# Altium schematic sheet ver060_MCU.SchDoc
size A3; SheetNumber: 5; SheetTotal: 6
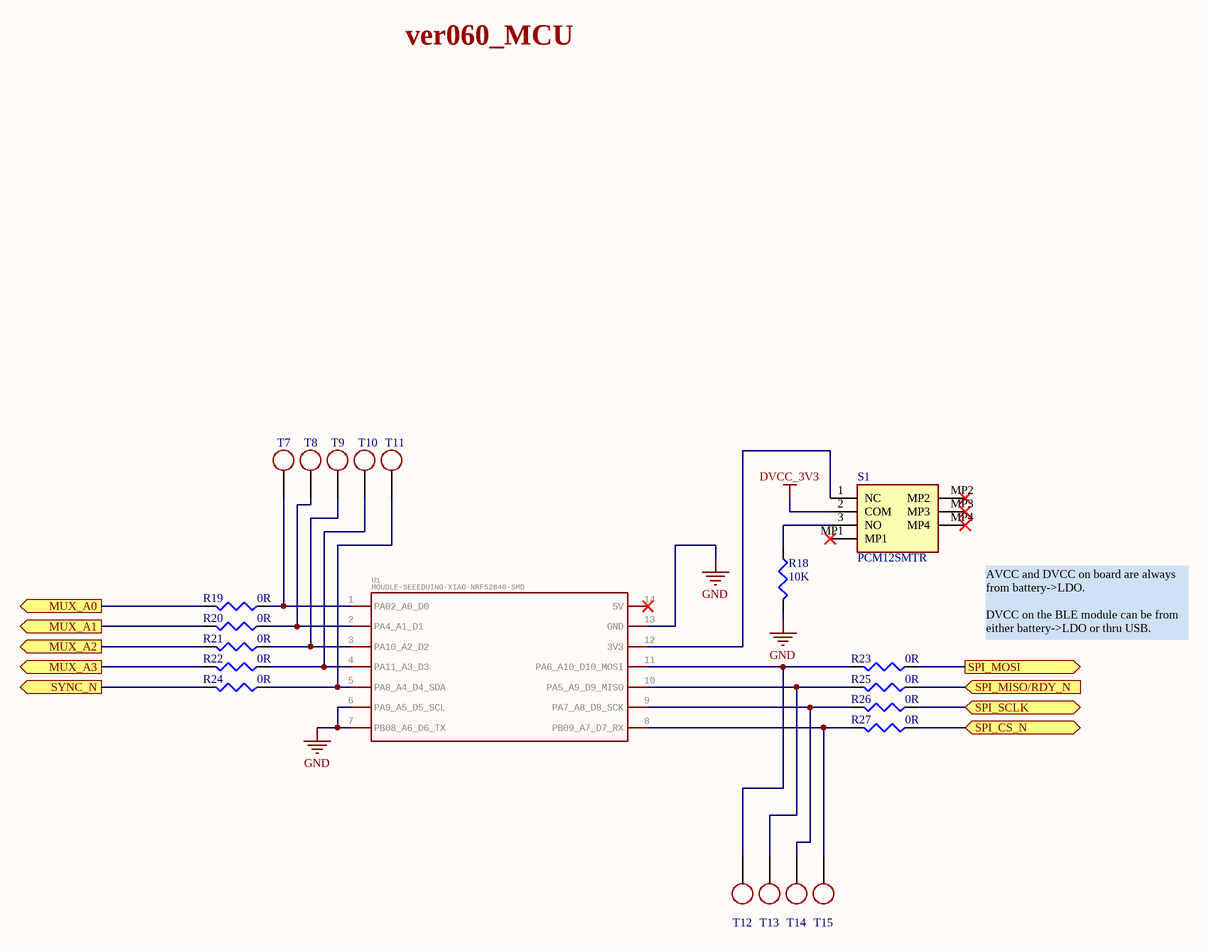
[diagram p0: ver060_MCU.SchDoc]

## Parts
R18  value 10K  [J1-0603]  (hidden comment: Res3)
R19  value 0R  [J1-0603]  (hidden comment: Res3)
R20  value 0R  [J1-0603]  (hidden comment: Res3)
R21  value 0R  [J1-0603]  (hidden comment: Res3)
R22  value 0R  [J1-0603]  (hidden comment: Res3)
R23  value 0R  [J1-0603]  (hidden comment: Res3)
R24  value 0R  [J1-0603]  (hidden comment: Res3)
R25  value 0R  [J1-0603]  (hidden comment: Res3)
R26  value 0R  [J1-0603]  (hidden comment: Res3)
R27  value 0R  [J1-0603]  (hidden comment: Res3)
S1  PCM12SMTR  [PCM12SMTR]
T7  TP_SMT  [TP_SMT_Round_0.6x0.6]  (value not drawn)
T8  TP_SMT  [TP_SMT_Round_0.6x0.6]  (value not drawn)
T9  TP_SMT  [TP_SMT_Round_0.6x0.6]  (value not drawn)
T10  TP_SMT  [TP_SMT_Round_0.6x0.6]  (value not drawn)
T11  TP_SMT  [TP_SMT_Round_0.6x0.6]  (value not drawn)
T12  TP_SMT  [TP_SMT_Round_0.6x0.6]  (value not drawn)
T13  TP_SMT  [TP_SMT_Round_0.6x0.6]  (value not drawn)
T14  TP_SMT  [TP_SMT_Round_0.6x0.6]  (value not drawn)
T15  TP_SMT  [TP_SMT_Round_0.6x0.6]  (value not drawn)
U1  MOUDLE-SEEEDUINO-XIAO-NRF52840-SMD  [MOUDLE16P-SMD-2-54-21X17-8MM]

## Ports
MUX_A0 (out), MUX_A1 (out), MUX_A2 (out), MUX_A3 (out), SPI_CS_N (bidir), SPI_MISO/RDY_N (in), SPI_MOSI (out), SPI_SCLK (bidir), SYNC_N (out)

## Nets
DVCC_3V3: S1.2(COM)
GND: R18.2 U1.6(PA9_A5_D5_SCL) U1.7(PB08_A6_D6_TX) U1.13(GND)
MUX_A0: R19.2 ; port MUX_A0
MUX_A1: R20.2 ; port MUX_A1
MUX_A2: R21.2 ; port MUX_A2
MUX_A3: R22.2 ; port MUX_A3
SPI_CS_N: R27.1 ; port SPI_CS_N
SPI_MISO/RDY_N: R25.1 ; port SPI_MISO/RDY_N
SPI_MOSI: R23.1 ; port SPI_MOSI
SPI_SCLK: R26.1 ; port SPI_SCLK
SYNC_N: R24.2 ; port SYNC_N
NetR18_1: R18.1 S1.3(NO)
NetR19_1: R19.1 T7.1 U1.1(PA02_A0_D0)
NetR20_1: R20.1 T8.1 U1.2(PA4_A1_D1)
NetR21_1: R21.1 T9.1 U1.3(PA10_A2_D2)
NetR22_1: R22.1 T10.1 U1.4(PA11_A3_D3)
NetR23_2: R23.2 T12.1 U1.11(PA6_A10_D10_MOSI)
NetR24_1: R24.1 T11.1 U1.5(PA8_A4_D4_SDA)
NetR25_2: R25.2 T13.1 U1.10(PA5_A9_D9_MISO)
NetR26_2: R26.2 T14.1 U1.9(PA7_A8_D8_SCK)
NetR27_2: R27.2 T15.1 U1.8(PB09_A7_D7_RX)
NetS1_1: S1.1(NC) U1.12(3V3)

Not connected (* = marked no-connect by the designer): S1 MP1* MP2* MP3* MP4*; U1 14(5V)*

## Notes on the sheet
- ver060_MCU
- AVCC and DVCC on board are always from battery->LDO.
  DVCC on the BLE module can be from  either battery->LDO or thru USB.

## Library data of the parts
R18-R27 = Res3: Resistor; Published: 8-Jun-2000; LatestRevisionDate: 29-May-2009; LatestRevisionNote: IPC-7351 Footprint Added.; PackageReference: J1-0603; Publisher: Altium Limited; PackageDescription: Chip Resistor
S1 = PCM12SMTR: Switch; Manufacturer_Name: C & K COMPONENTS; Datasheet Link: https://www.ckswitches.com/media/1424/pcm.pdf; Height: 1.4mm; Manufacturer_Part_Number: PCM12SMTR; Mouser Part Number: 611-PCM12SMTR; Mouser Price/Stock: https://www.mouser.co.uk/ProductDetail/CK/PCM12SMTR?qs=mfFuHy8STfL3qrPSfCHA7w%3D%3D; Arrow Part Number: PCM12SMTR; Arrow Price/Stock: https://www.arrow.com/en/products/pcm12smtr/ck?region=nac
U1 = MOUDLE-SEEEDUINO-XIAO-NRF52840-SMD: GateName_1: G$1; DeviceName: -SMD; SymbolName_1: MOUDLE-SEEEDUINO-XIAO-NRF52840; LibraryName: Seeed-Studio-XIAO-nRF52840-footprint-eagle; DeviceSetName: MOUDLE-SEEEDUINO-XIAO-NRF52840; Package: MOUDLE16P-SMD-2.54-21X17.8MM